# Altium project NizoviePCBProject.PrjPcb
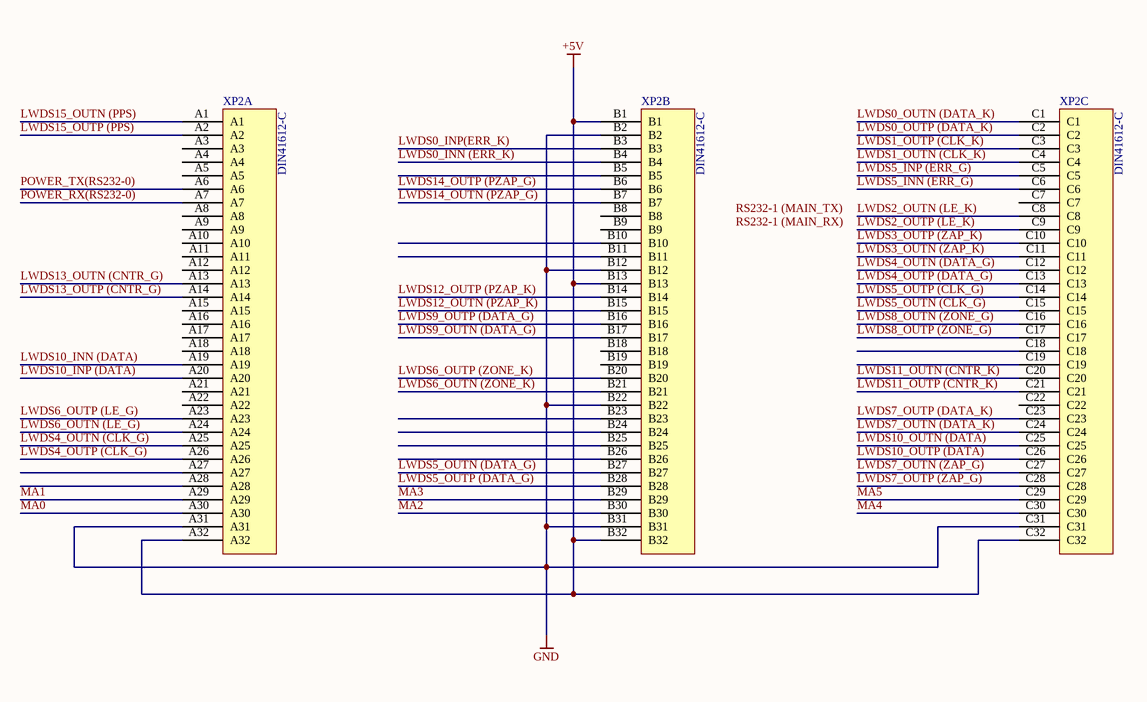
[diagram p0: Sheet_1_nizovie.SchDoc]
4 sheets, 75 parts. Net scope: global (net labels, ports and power ports of the same name join across sheets).
Sheets:
  Sheet_1_nizovie.SchDoc
  Sheet_2_nizovie.SchDoc
  Sheet_3_nizovie.SchDoc
  Sheet_4_nizovie.SchDoc

## Sheet Sheet_1_nizovie.SchDoc
size A4

### Parts
XP2  DIN41612-C  [DIN41612C]  (parts A,B,C of 3)

### Nets
+5V: XP2.A32 XP2.B1 XP2.B13 XP2.B32 XP2.C32
GND: XP2.A31 XP2.B2 XP2.B12 XP2.B22 XP2.B31 XP2.C31
LWDS0_INN (ERR_K): XP2.B4
LWDS0_INP(ERR_K): XP2.B3
LWDS0_OUTN (DATA_K): XP2.C1
LWDS0_OUTP (DATA_K): XP2.C2
LWDS1_OUTN (CLK_K): XP2.C4
LWDS1_OUTP (CLK_K): XP2.C3
LWDS2_OUTN (LE_K): XP2.C8
LWDS2_OUTP (LE_K): XP2.C9
LWDS3_OUTN (ZAP_K): XP2.C11
LWDS3_OUTP (ZAP_K): XP2.C10
LWDS4_OUTN (CLK_G): XP2.A25
LWDS4_OUTN (DATA_G): XP2.C12
LWDS4_OUTP (CLK_G): XP2.A26
LWDS4_OUTP (DATA_G): XP2.C13
LWDS5_INN (ERR_G): XP2.C6
LWDS5_INP (ERR_G): XP2.C5
LWDS5_OUTN (CLK_G): XP2.C15
LWDS5_OUTN (DATA_G): XP2.B27
LWDS5_OUTP (CLK_G): XP2.C14
LWDS5_OUTP (DATA_G): XP2.B28
LWDS6_OUTN (LE_G): XP2.A24
LWDS6_OUTN (ZONE_K): XP2.B21
LWDS6_OUTP (LE_G): XP2.A23
LWDS6_OUTP (ZONE_K): XP2.B20
LWDS7_OUTN (DATA_K): XP2.C24
LWDS7_OUTN (ZAP_G): XP2.C27
LWDS7_OUTP (DATA_K): XP2.C23
LWDS7_OUTP (ZAP_G): XP2.C28
LWDS8_OUTN (ZONE_G): XP2.C16
LWDS8_OUTP (ZONE_G): XP2.C17
LWDS9_OUTN (DATA_G): XP2.B17
LWDS9_OUTP (DATA_G): XP2.B16
LWDS10_INN (DATA): XP2.A19
LWDS10_INP (DATA): XP2.A20
LWDS10_OUTN (DATA): XP2.C25
LWDS10_OUTP (DATA): XP2.C26
LWDS11_OUTN (CNTR_K): XP2.C20
LWDS11_OUTP (CNTR_K): XP2.C21
LWDS12_OUTN (PZAP_K): XP2.B15
LWDS12_OUTP (PZAP_K): XP2.B14
LWDS13_OUTN (CNTR_G): XP2.A13
LWDS13_OUTP (CNTR_G): XP2.A14
LWDS14_OUTN (PZAP_G): XP2.B7
LWDS14_OUTP (PZAP_G): XP2.B6
LWDS15_OUTN (PPS): XP2.A1
LWDS15_OUTP (PPS): XP2.A2
MA0: XP2.A30
MA1: XP2.A29
MA2: XP2.B30
MA3: XP2.B29
MA4: XP2.C30
MA5: XP2.C29
POWER_RX(RS232-0): XP2.A7
POWER_TX(RS232-0): XP2.A6

Not connected (* = marked no-connect by the designer): XP2 A3 A4 A5 A8 A9 A10 A11 A12 A15 A16 A17 A18 A21 A22 A27 A28 B5 B8 B9 B10 B11 B18 B19 B23 B24 B25 B26 C7 C18 C19 C22

### Notes on the sheet
- Labels drawn without touching a wire or pin: RS232-1 (MAIN_RX), RS232-1 (MAIN_TX)

## Sheet Sheet_2_nizovie.SchDoc
size A4
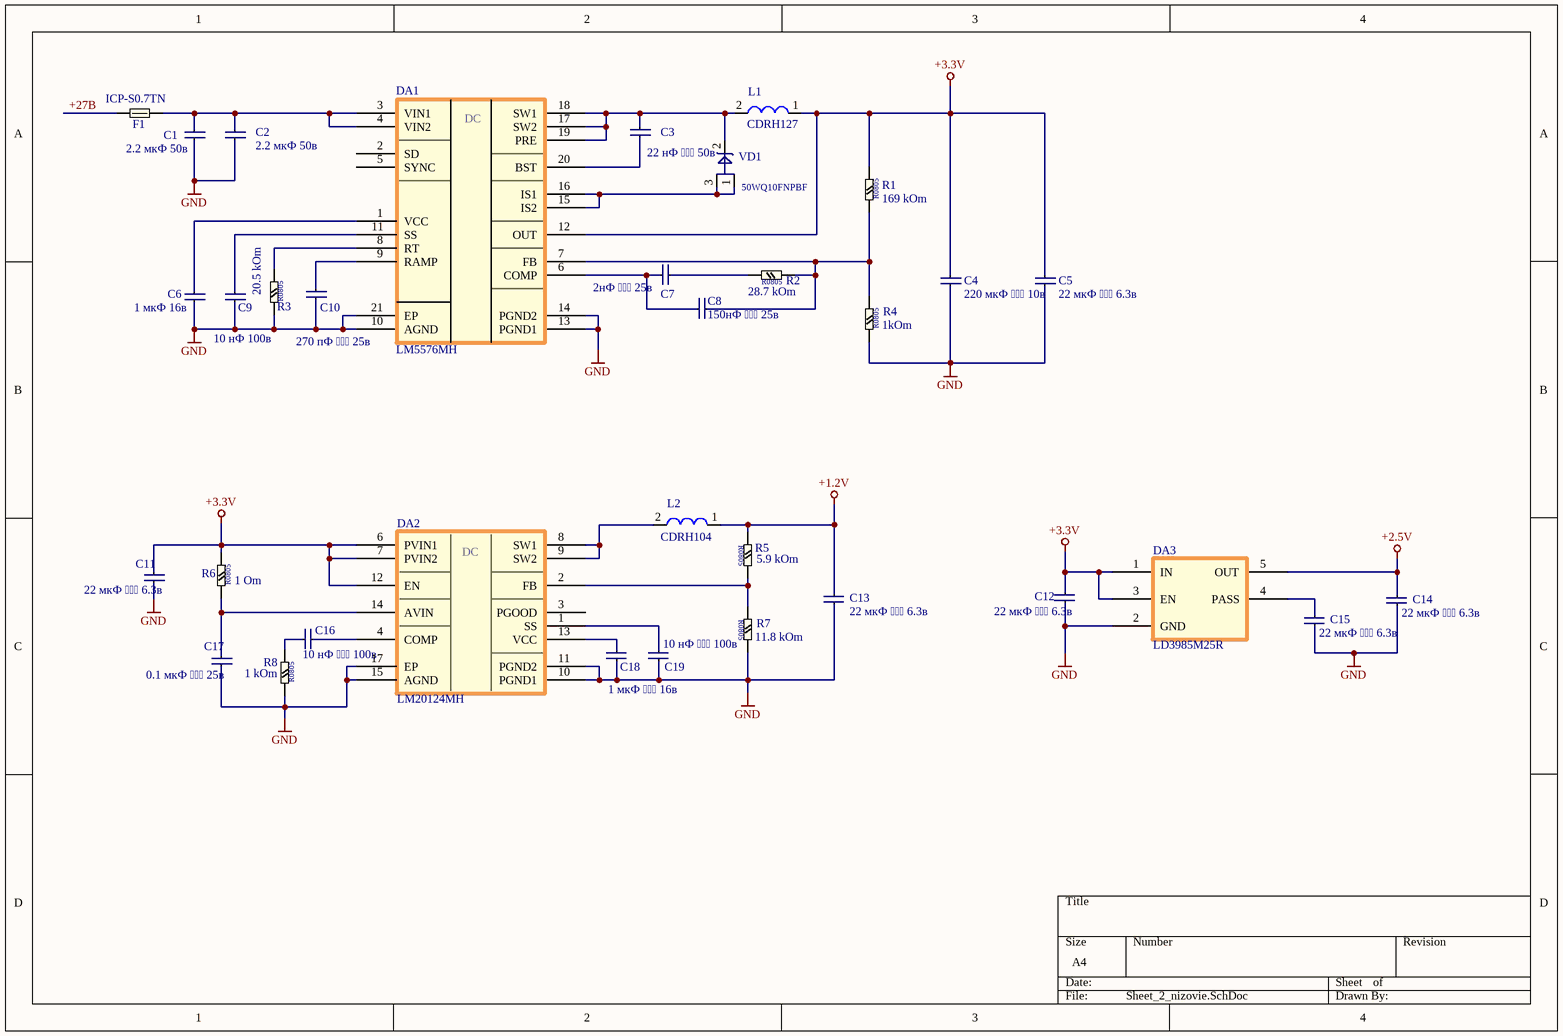
[diagram p1: Sheet_2_nizovie.SchDoc]

### Parts
C1  2.2 мкФ 50в  [FP_0805]
C2  2.2 мкФ 50в  [FP_0805]
C3  22 нФ  50в  [FP_0805]
C4  220 мкФ  10в  [TYPE_D]
C5  22 мкФ  6.3в  [FP_0805]
C6  1 мкФ 16в  [FP_0805]
C7  2нФ  25в  [FP_0805]
C8  150нФ  25в  [FP_0805]
C9  10 нФ 100в  [FP_0805]
C10  270 пФ  25в  [FP_0805]
C11  22 мкФ  6.3в  [FP_0805]
C12  22 мкФ  6.3в  [FP_0805]
C13  22 мкФ  6.3в  [FP_0805]
C14  22 мкФ  6.3в  [FP_0805]
C15  22 мкФ  6.3в  [FP_0805]
C16  10 нФ  100в  [FP_0805]
C17  0.1 мкФ  25в  [FP_0805]
C18  1 мкФ  16в  [FP_0805]
C19  10 нФ  100в  [FP_0805]
DA1  LM5576MH  [LM5576]
DA2  LM20124MH  [LM20124]
DA3  LD3985M25R  [LD3985]
F1  ICP-S0.7TN  [ICP-S0.7]
L1  CDRH127  [CDRH127]
L2  CDRH104  [CDRH104R]
R1  169 kOm  [FP_0805]
R2  28.7 kOm  [FP_0805]
R3  20.5 kOm  [FP_0805]
R4  1kOm  [FP_0805]
R5  5.9 kOm  [FP_0805]
R6  1 Om  [FP_0805]
R7  11.8 kOm  [FP_0805]
R8  1 kOm  [FP_0805]
VD1  50WQ10FNPBF  [50WQ06]

### Nets
+1.2V: C13.1 L2.1 R5.1
+2.5V: C14.1 DA3.5(OUT)
+3.3V: C4.2 C5.2 C11.2 C12.1 DA1.12(OUT) DA2.6(PVIN1) DA2.7(PVIN2) DA2.12(EN) DA3.1(IN) DA3.3(EN) L1.1 R1.2 R6.2
GND: C1.1 C2.1 C4.1 C5.1 C6.1 C9.1 C10.1 C11.1 C12.2 C13.2 C14.2 C15.2 C17.1 C18.2 C19.2 DA1.10(AGND) DA1.13(PGND1) DA1.14(PGND2) DA1.21(EP) DA2.10(PGND1) DA2.11(PGND2) DA2.15(AGND) DA2.17(EP) DA3.2(GND) R3.1 R4.1 R7.2 R8.1
+27В: F1.1
NetC1_2: C1.2 C2.2 DA1.3(VIN1) DA1.4(VIN2) F1.2
NetC3_1: C3.1 DA1.20(BST)
NetC3_2: C3.2 DA1.17(SW2) DA1.18(SW1) DA1.19(PRE) L1.2 VD1.2
NetC6_2: C6.2 DA1.1(VCC)
NetC7_1: C7.1 R2.1
NetC7_2: C7.2 C8.2 DA1.6(COMP)
NetC8_1: C8.1 DA1.7(FB) R1.1 R2.2 R4.2
NetC9_2: C9.2 DA1.11(SS)
NetC10_2: C10.2 DA1.9(RAMP)
NetC15_1: C15.1 DA3.4(PASS)
NetC16_1: C16.1 DA2.4(COMP)
NetC16_2: C16.2 R8.2
NetC17_2: C17.2 DA2.14(AVIN) R6.1
NetC18_1: C18.1 DA2.13(VCC)
NetC19_1: C19.1 DA2.1(SS)
NetDA1_8: DA1.8(RT) R3.2
NetDA1_15: DA1.15(IS2) DA1.16(IS1) VD1.1 VD1.3
NetDA2_2: DA2.2(FB) R5.2 R7.1
NetDA2_8: DA2.8(SW1) DA2.9(SW2) L2.2

Not connected (* = marked no-connect by the designer): DA1 2(SD) 5(SYNC); DA2 3(PGOOD)

### Notes on the sheet
- (in symbol LM5576MH) DC
- (in symbol LM20124MH) DC

### Library data of the parts
C1-C19 = C0805
R1-R3 R5-R8 = R0805: 1kOm
R4 = R0805

## Sheet Sheet_3_nizovie.SchDoc
size A4
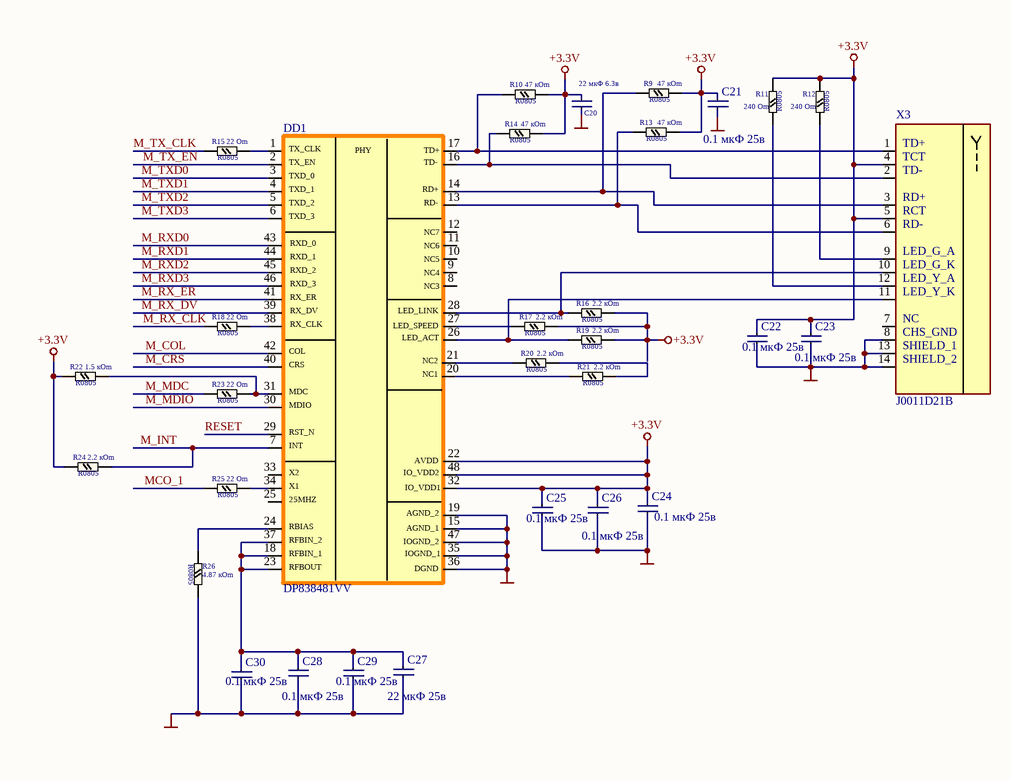
[diagram p2: Sheet_3_nizovie.SchDoc]

### Parts
C20  22 мкФ 6.3в  [FP_0805]
C21  0.1 мкФ 25в  [FP_0805]
C22  0.1 мкФ 25в  [FP_0805]
C23  0.1 мкФ 25в  [FP_0805]
C24  0.1 мкФ 25в  [FP_0805]
C25  0.1 мкФ 25в  [FP_0805]
C26  0.1 мкФ 25в  [FP_0805]
C27  22 мкФ 25в  [FP_0805]
C28  0.1 мкФ 25в  [FP_0805]
C29  0.1 мкФ 25в  [FP_0805]
C30  0.1 мкФ 25в  [FP_0805]
DD1  DP838481VV  [TSQFP50P905X905X140-48N]
R9  47 кОm  [FP_0805]
R10  47 кОm  [FP_0805]
R11  240 Оm  [FP_0805]
R12  240 Оm  [FP_0805]
R13  47 кОm  [FP_0805]
R14  47 кОm  [FP_0805]
R15  22 Оm  [FP_0805]
R16  2.2 кОm  [FP_0805]
R17  2.2 кОm  [FP_0805]
R18  22 Оm  [FP_0805]
R19  2.2 кОm  [FP_0805]
R20  2.2 кОm  [FP_0805]
R21  2.2 кОm  [FP_0805]
R22  1.5 кОm  [FP_0805]
R23  22 Оm  [FP_0805]
R24  2.2 кОm  [FP_0805]
R25  22 Оm  [FP_0805]
R26  4.87 кОm  [FP_0805]
X3  J0011D21B  [J0006D21BNL]

### Nets
+3.3V: C20.2 C21.2 C22.2 C23.2 C24.2 C25.2 C26.2 DD1.22 DD1.32 DD1.48 R9.2 R10.2 R11.2 R12.2 R13.2 R14.2 R16.2 R17.2 R19.2 R22.1 R24.1 X3.4 X3.5
GND: C20.1 C21.1 C22.1 C23.1 C24.1 C25.1 C26.1 C27.1 C28.1 C29.1 C30.1 DD1.15 DD1.19 DD1.35 DD1.36 DD1.47 R26.2 X3.8 X3.13 X3.14
M_COL: DD1.42
M_CRS: DD1.40
M_INT: DD1.7 R24.2
M_MDC: R23.1
M_MDIO: DD1.30
M_RX_CLK: R18.1
M_RX_DV: DD1.39
M_RX_ER: DD1.41
M_RXD0: DD1.43
M_RXD1: DD1.44
M_RXD2: DD1.45
M_RXD3: DD1.46
M_TX_CLK: R15.1
M_TX_EN: DD1.2
M_TXD0: DD1.3
M_TXD1: DD1.4
M_TXD2: DD1.5
M_TXD3: DD1.6
MCO_1: R25.1
RESET: DD1.29
NetC27_2: C27.2 C28.2 C29.2 C30.2 DD1.18 DD1.23 DD1.37
NetDD1_1: DD1.1 R15.2
NetDD1_13: DD1.13 R13.1 X3.6
NetDD1_14: DD1.14 R9.1 X3.3
NetDD1_16: DD1.16 R14.1 X3.2
NetDD1_17: DD1.17 R10.1 X3.1
NetDD1_20: DD1.20 R21.1
NetDD1_21: DD1.21 R20.1
NetDD1_24: DD1.24 R26.1
NetDD1_26: DD1.26 R19.1 X3.11
NetDD1_27: DD1.27 R17.1
NetDD1_28: DD1.28 R16.1 X3.10
NetDD1_31: DD1.31 R22.2 R23.2
NetDD1_34: DD1.34 R25.2
NetDD1_38: DD1.38 R18.2
NetR11_1: R11.1 X3.12
NetR12_1: R12.1 X3.9
NetR20_2: R20.2 R21.2

Not connected (* = marked no-connect by the designer): DD1 8 9 10 11 12 25 33; X3 7

### Notes on the sheet
- (in symbol DP838481VV) TX_CLK; PHY; TD+; TX_EN; TD-; TXD_0; TXD_1; RD+; TXD_2; RD-; TXD_3; NC7; RXD_0; NC6; RXD_1; NC5; RXD_2; NC4; RXD_3; NC3; RX_ER; RX_DV; LED_LINK; RX_CLK; LED_SPEED; LED_ACT; COL; CRS; NC2; NC1; MDC; MDIO; RST_N; INT; AVDD; X2; IO_VDD2; X1; IO_VDD1; 25MHZ; AGND_2; RBIAS; AGND_1; RFBIN_2; IOGND_2; RFBIN_1; IOGND_1; RFBOUT; DGND
- (in symbol J0011D21B) TD+; TCT; TD-; RD+; RCT; RD-; LED_G_A; LED_G_K; LED_Y_A; LED_Y_K; NC; CHS_GND; SHIELD_1; SHIELD_2

### Library data of the parts
C20-C30 = C0805
R9-R26 = R0805

## Sheet Sheet_4_nizovie.SchDoc
size A4
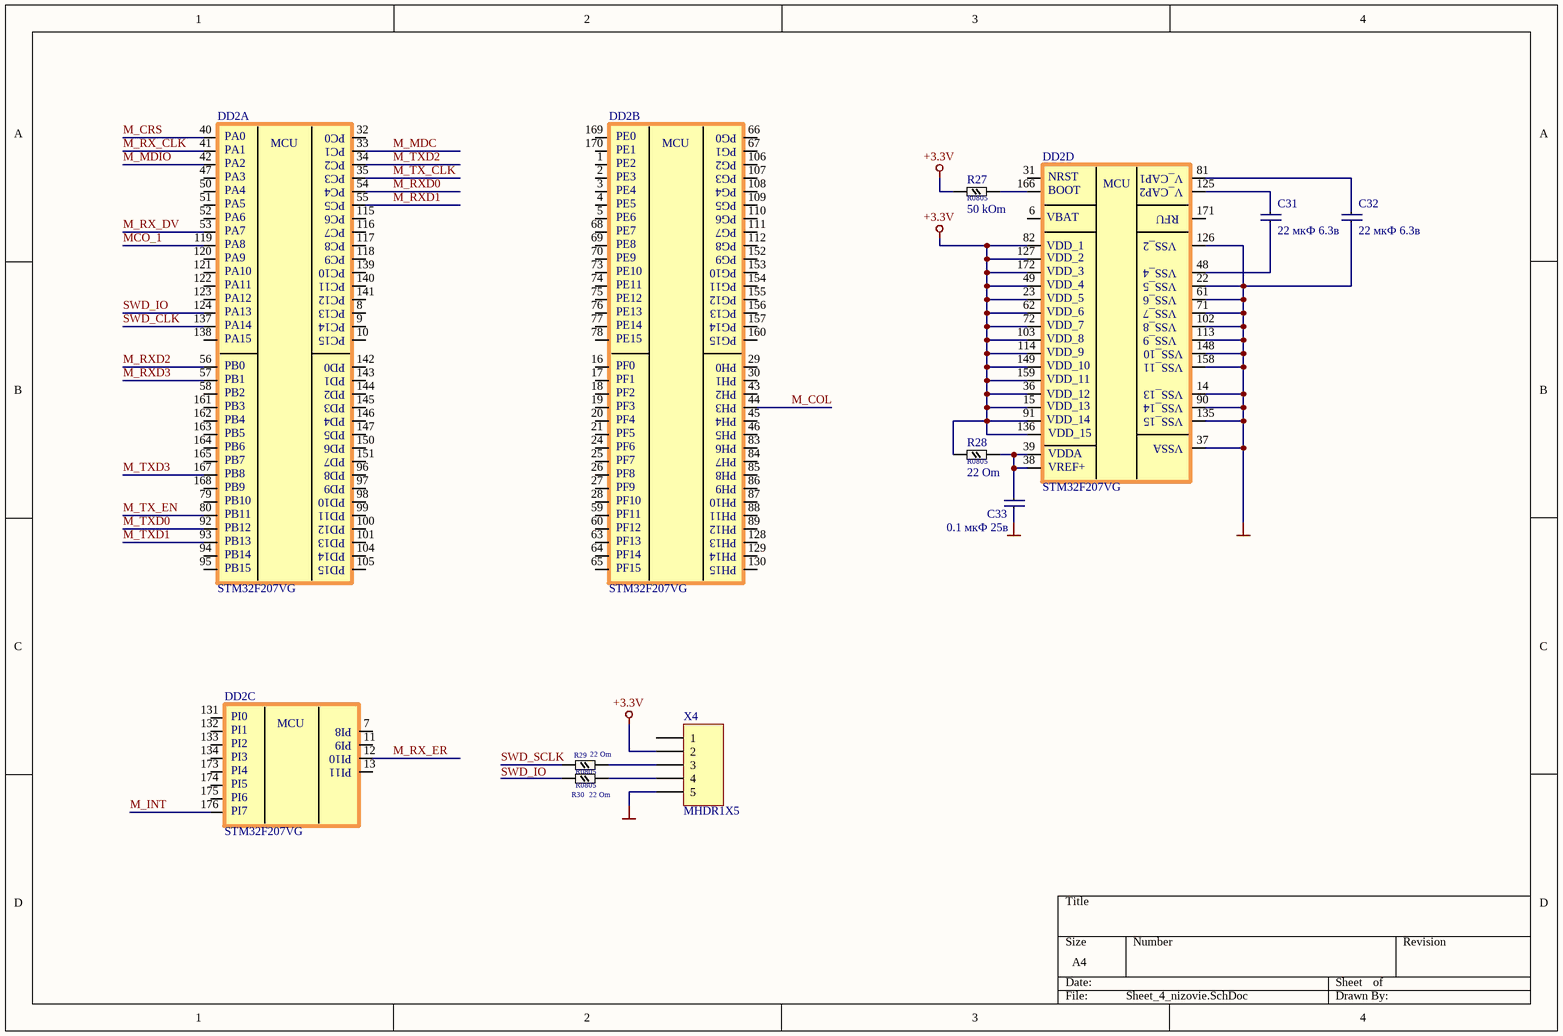
[diagram p3: Sheet_4_nizovie.SchDoc]

### Parts
C31  22 мкФ 6.3в  [FP_0805]
C32  22 мкФ 6.3в  [FP_0805]
C33  0.1 мкФ 25в  [FP_0805]
DD2  STM32F207VG  [TSQFP50P2600X2600X160-176N]  (parts A,B,C,D of 4)
R27  50 kOm  [FP_0805]
R28  22 Om  [FP_0805]
R29  22 Om  [FP_0805]
R30  22 Om  [FP_0805]
X4  MHDR1X5  [MHDR1X5]

### Nets
+3.3V: DD2.15 DD2.23 DD2.36 DD2.49 DD2.62 DD2.72 DD2.82 DD2.91 DD2.103 DD2.114 DD2.127 DD2.136 DD2.149 DD2.159 DD2.172 R27.1 R28.1 X4.2
GND: C32.1 C33.1 DD2.14 DD2.22 DD2.37 DD2.61 DD2.71 DD2.90 DD2.102 DD2.113 DD2.126 DD2.135 DD2.148 DD2.158 X4.5
M_COL: DD2.44
M_CRS: DD2.40
M_INT: DD2.176
M_MDC: DD2.33
M_MDIO: DD2.42
M_RX_CLK: DD2.41
M_RX_DV: DD2.53
M_RX_ER: DD2.12
M_RXD0: DD2.54
M_RXD1: DD2.55
M_RXD2: DD2.56
M_RXD3: DD2.57
M_TX_CLK: DD2.35
M_TX_EN: DD2.80
M_TXD0: DD2.92
M_TXD1: DD2.93
M_TXD2: DD2.34
M_TXD3: DD2.167
MCO_1: DD2.119
SWD_CLK: DD2.137
SWD_IO: DD2.124
SWD_SCLK: R29.1
NetC31_1: C31.1 DD2.48
NetC31_2: C31.2 DD2.125
NetC32_2: C32.2 DD2.81
NetC33_2: C33.2 DD2.38 DD2.39 R28.2
NetDD2_166: DD2.166 R27.2
NetR29_2: R29.2 X4.3
NetR30_2: R30.2 X4.4

Not connected (* = marked no-connect by the designer): DD2 1 2 3 4 5 6 7 8 9 10 11 13 16 17 18 19 20 21 24 25 26 27 28 29 30 31 32 43 45 46 47 50 51 52 58 59 60 63 64 65 66 67 68 69 70 73 74 75 76 77 78 79 83 84 85 86 87 88 89 94 95 96 97 98 99 100 101 104 105 106 107 108 109 110 111 112 115 116 117 118 120 121 122 123 128 129 130 131 132 133 134 138 139 140 141 142 143 144 145 146 147 150 151 152 153 154 155 156 157 160 161 162 163 164 165 168 169 170 171 173 174 175; R30 1; X4 1

### Notes on the sheet
- Labels drawn without touching a wire or pin: SWD_IO
- (in symbol STM32D207VG, part A) PC0; PA0; PC1; MCU; PA1; PC2; PA2; PC3; PA3; PC4; PA4; PC5; PA5; PC6; PA6; PC7; PA7; PC8; PA8; PC9; PA9; PC10; PA10; PC11; PA11; PC12; PA12; PC13; PA13; PC14; PA14; PC15; PA15; PD0; PB0; PD1; PB1; PD2; PB2; PD3; PB3; PD4; PB4; PD5; PB5; PD6; PB6; PD7; PB7; PD8; PB8; PD9; PB9; PD10; PB10; PD11; PB11; PD12; PB12; PD13; PB13; PD14; PB14; PD15; PB15
- (in symbol STM32D207VG, part B) PG0; PE0; PG1; MCU; PE1; PG2; PE2; PG3; PE3; PG4; PE4; PG5; PE5; PG6; PE6; PG7; PE7; PG8; PE8; PG9; PE9; PG10; PE10; PG11; PE11; PG12; PE12; PC13; PE13; PG14; PE14; PG15; PE15; PH0; PF0; PH1; PF1; PH2; PF2; PH3; PF3; PH4; PF4; PH5; PF5; PH6; PF6; PH7; PF7; PH8; PF8; PH9; PF9; PH10; PF10; PH11; PF11; PH12; PF12; PH13; PF13; PH14; PF14; PH15; PF15
- (in symbol STM32D207VG, part C) PI0; PI8; MCU; PI1; PI9; PI2; PI10; PI3; PI11; PI4; PI5; PI6; PI7
- (in symbol STM32D207VG, part D) V_CAP1; NRST; V_CAP2; MCU; BOOT; RFU; VBAT; VSS_2; VDD_1; VDD_2; VSS_4; VDD_3; VSS_5; VDD_4; VSS_6; VDD_5; VSS_7; VDD_6; VSS_8; VDD_7; VSS_9; VDD_8; VSS_10; VDD_9; VSS_11; VDD_10; VDD_11; VSS_13; VDD_12; VSS_14; VDD_13; VSS_15; VDD_14; VDD_15; VSSA; VDDA; VREF+

### Library data of the parts
C31-C33 = C0805
DD2 = STM32D207VG: STM32
R27-R30 = R0805
X4 = MHDR1X5: Header, 5-Pin; LatestRevisionDate: 17-Jul-2002; LatestRevisionNote: Re-released for DXP Platform.; Publisher: Altium Limited

## Nets that join several sheets
+3.3V: Sheet_2_nizovie (13 pins), Sheet_3_nizovie (23 pins), Sheet_4_nizovie (18 pins)
GND: Sheet_1_nizovie (6 pins), Sheet_2_nizovie (28 pins), Sheet_3_nizovie (20 pins), Sheet_4_nizovie (15 pins)
M_COL: Sheet_3_nizovie (DD1.42), Sheet_4_nizovie (DD2.44)
M_CRS: Sheet_3_nizovie (DD1.40), Sheet_4_nizovie (DD2.40)
M_INT: Sheet_3_nizovie (DD1.7 R24.2), Sheet_4_nizovie (DD2.176)
M_MDC: Sheet_3_nizovie (R23.1), Sheet_4_nizovie (DD2.33)
M_MDIO: Sheet_3_nizovie (DD1.30), Sheet_4_nizovie (DD2.42)
M_RX_CLK: Sheet_3_nizovie (R18.1), Sheet_4_nizovie (DD2.41)
M_RX_DV: Sheet_3_nizovie (DD1.39), Sheet_4_nizovie (DD2.53)
M_RX_ER: Sheet_3_nizovie (DD1.41), Sheet_4_nizovie (DD2.12)
M_RXD0: Sheet_3_nizovie (DD1.43), Sheet_4_nizovie (DD2.54)
M_RXD1: Sheet_3_nizovie (DD1.44), Sheet_4_nizovie (DD2.55)
M_RXD2: Sheet_3_nizovie (DD1.45), Sheet_4_nizovie (DD2.56)
M_RXD3: Sheet_3_nizovie (DD1.46), Sheet_4_nizovie (DD2.57)
M_TX_CLK: Sheet_3_nizovie (R15.1), Sheet_4_nizovie (DD2.35)
M_TX_EN: Sheet_3_nizovie (DD1.2), Sheet_4_nizovie (DD2.80)
M_TXD0: Sheet_3_nizovie (DD1.3), Sheet_4_nizovie (DD2.92)
M_TXD1: Sheet_3_nizovie (DD1.4), Sheet_4_nizovie (DD2.93)
M_TXD2: Sheet_3_nizovie (DD1.5), Sheet_4_nizovie (DD2.34)
M_TXD3: Sheet_3_nizovie (DD1.6), Sheet_4_nizovie (DD2.167)
MCO_1: Sheet_3_nizovie (R25.1), Sheet_4_nizovie (DD2.119)